# Altium project STM32F407_Board.PrjPcb (part 1 of 3)
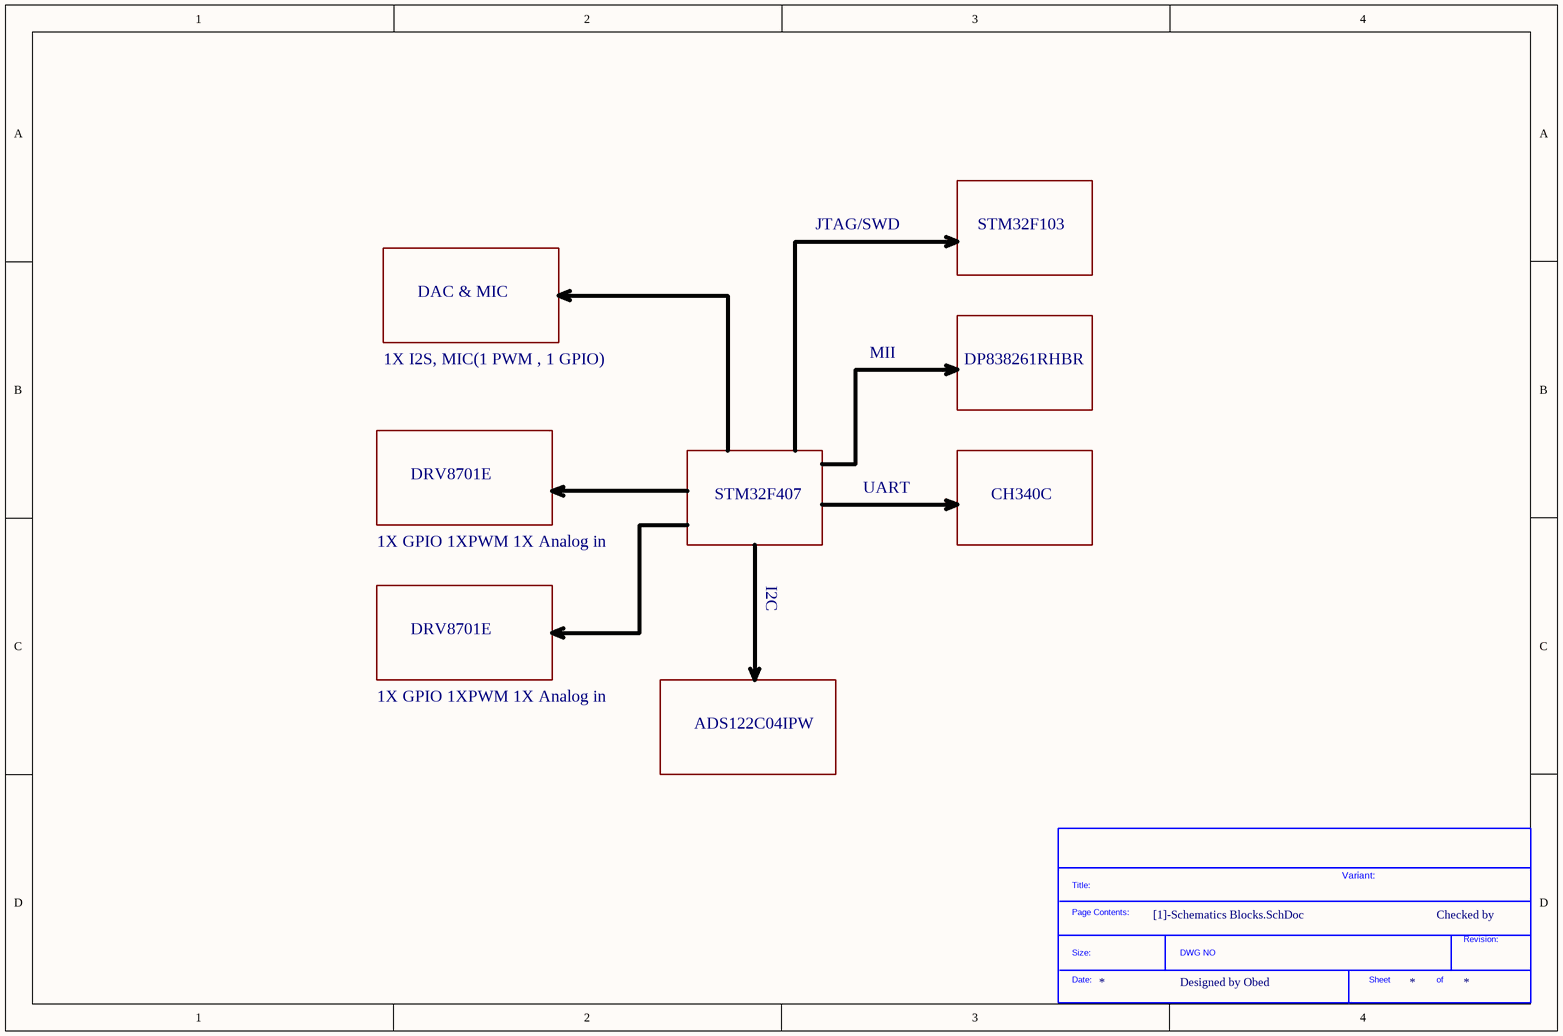
[diagram p0: [1]-Schematics Blocks.SchDoc]
11 sheets, 199 parts. Net scope: flat (ports and power ports of the same name join across sheets).
Board file: STM32F407_Board.PcbDoc
Sheets:
  [1]-Schematics Blocks.SchDoc
  [2]-Power Budget.SchDoc
  [3]-Debugger_STM32F103.SchDoc
  [4]-Ethernet_PHY.SchDoc
  [5]-Motor Driver_DRV8701.SchDoc
  [6]-CH340C.SchDoc
  [7]-ADC CHIP.SchDoc
  [8]-DAC & MIC.SchDoc
  [9]-STM32F407.SchDoc
  [10]-POWER.SchDoc
  [11]-Motor Driver_DRV8701_2.SchDoc

## Sheet [1]-Schematics Blocks.SchDoc
size A4

### Parts
(Parts that share a designator on the sheet are numbered #1, #2 ... from top to bottom, then left to right.)
*?#1  SDTitleBlock  (value not drawn)  (graphical)

### Notes on the sheet
- JTAG/SWD
- STM32F103
- DAC & MIC
- 1X I2S, MIC(1 PWM , 1 GPIO)
- MII
- DP838261RHBR
- DRV8701E
- STM32F407
- UART
- CH340C
- 1X GPIO 1XPWM 1X Analog in
- I2C
- ADS122C04IPW
- Variant:
- Checked by
- Designed by Obed
- (in symbol SDTitleBlock) Title:; Page Contents:; Revision:; Size:; DWG NO; Date:; Sheet; of

## Sheet [2]-Power Budget.SchDoc
size A4
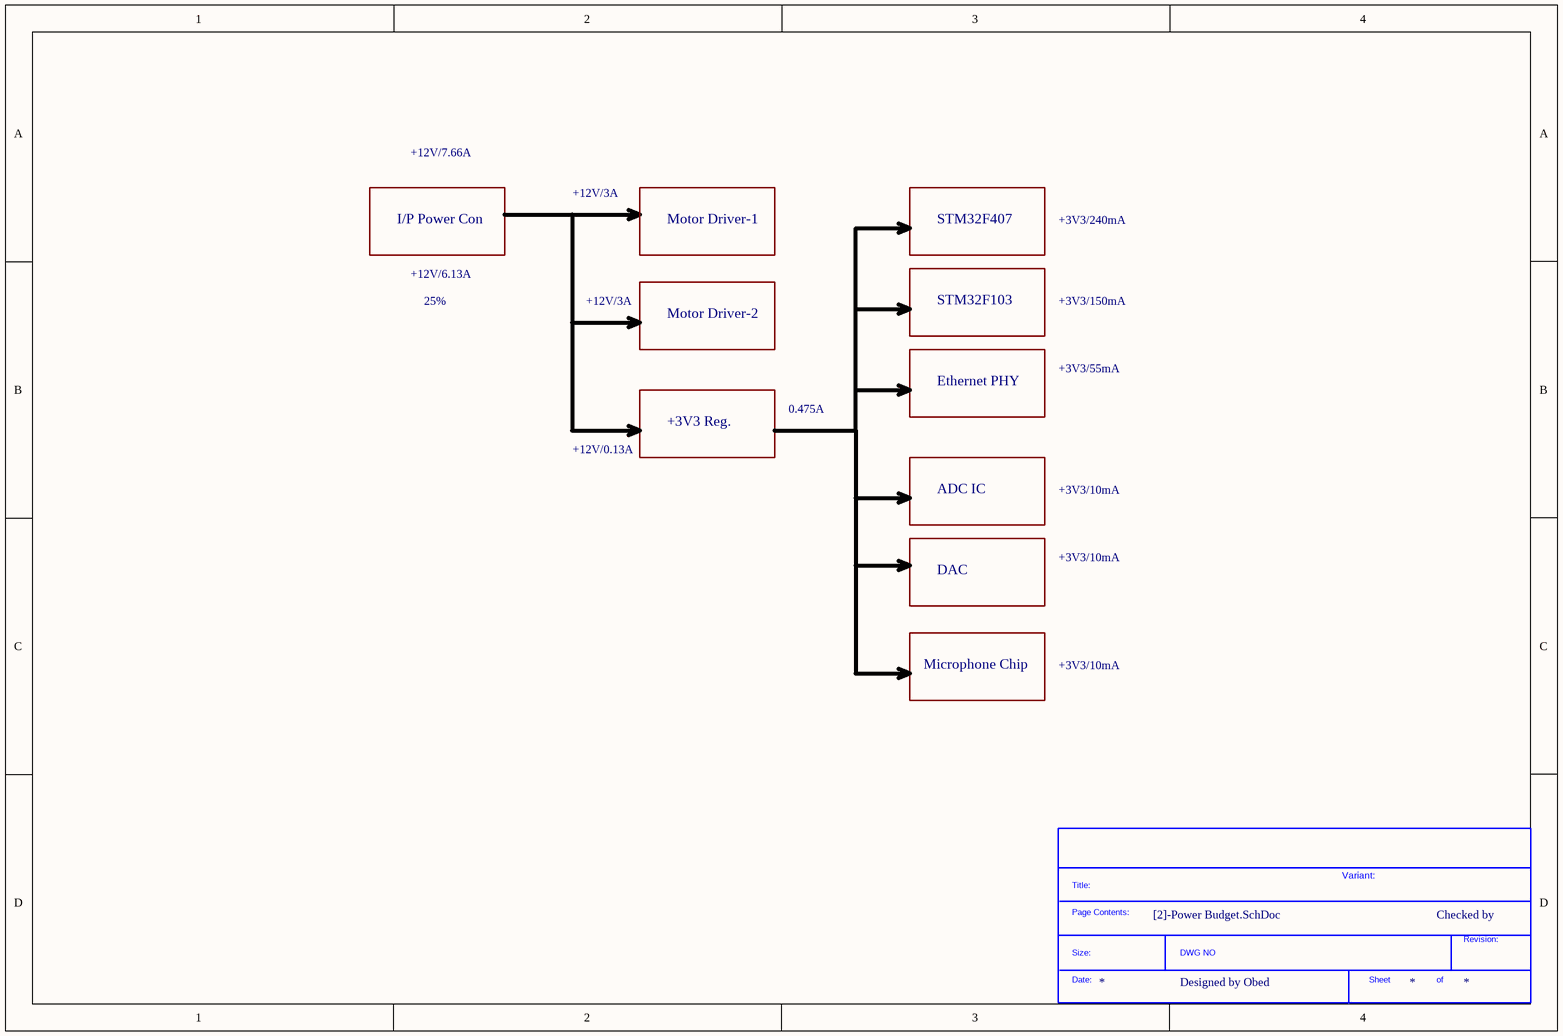
[diagram p1: [2]-Power Budget.SchDoc]

### Parts
(Parts that share a designator on the sheet are numbered #1, #2 ... from top to bottom, then left to right.)
*?#2  SDTitleBlock  (value not drawn)  (graphical)

### Notes on the sheet
- +12V/7.66A
- I/P Power Con
- +12V/3A
- Motor Driver-1
- STM32F407
- +3V3/240mA
- +12V/6.13A
- 25%
- STM32F103
- +3V3/150mA
- Motor Driver-2
- Ethernet PHY
- +3V3/55mA
- +3V3 Reg.
- 0.475A
- +12V/0.13A
- ADC IC
- +3V3/10mA
- DAC
- Microphone Chip
- Variant:
- Checked by
- Designed by Obed
- (in symbol SDTitleBlock) Title:; Page Contents:; Revision:; Size:; DWG NO; Date:; Sheet; of

## Sheet [3]-Debugger_STM32F103.SchDoc
size A4
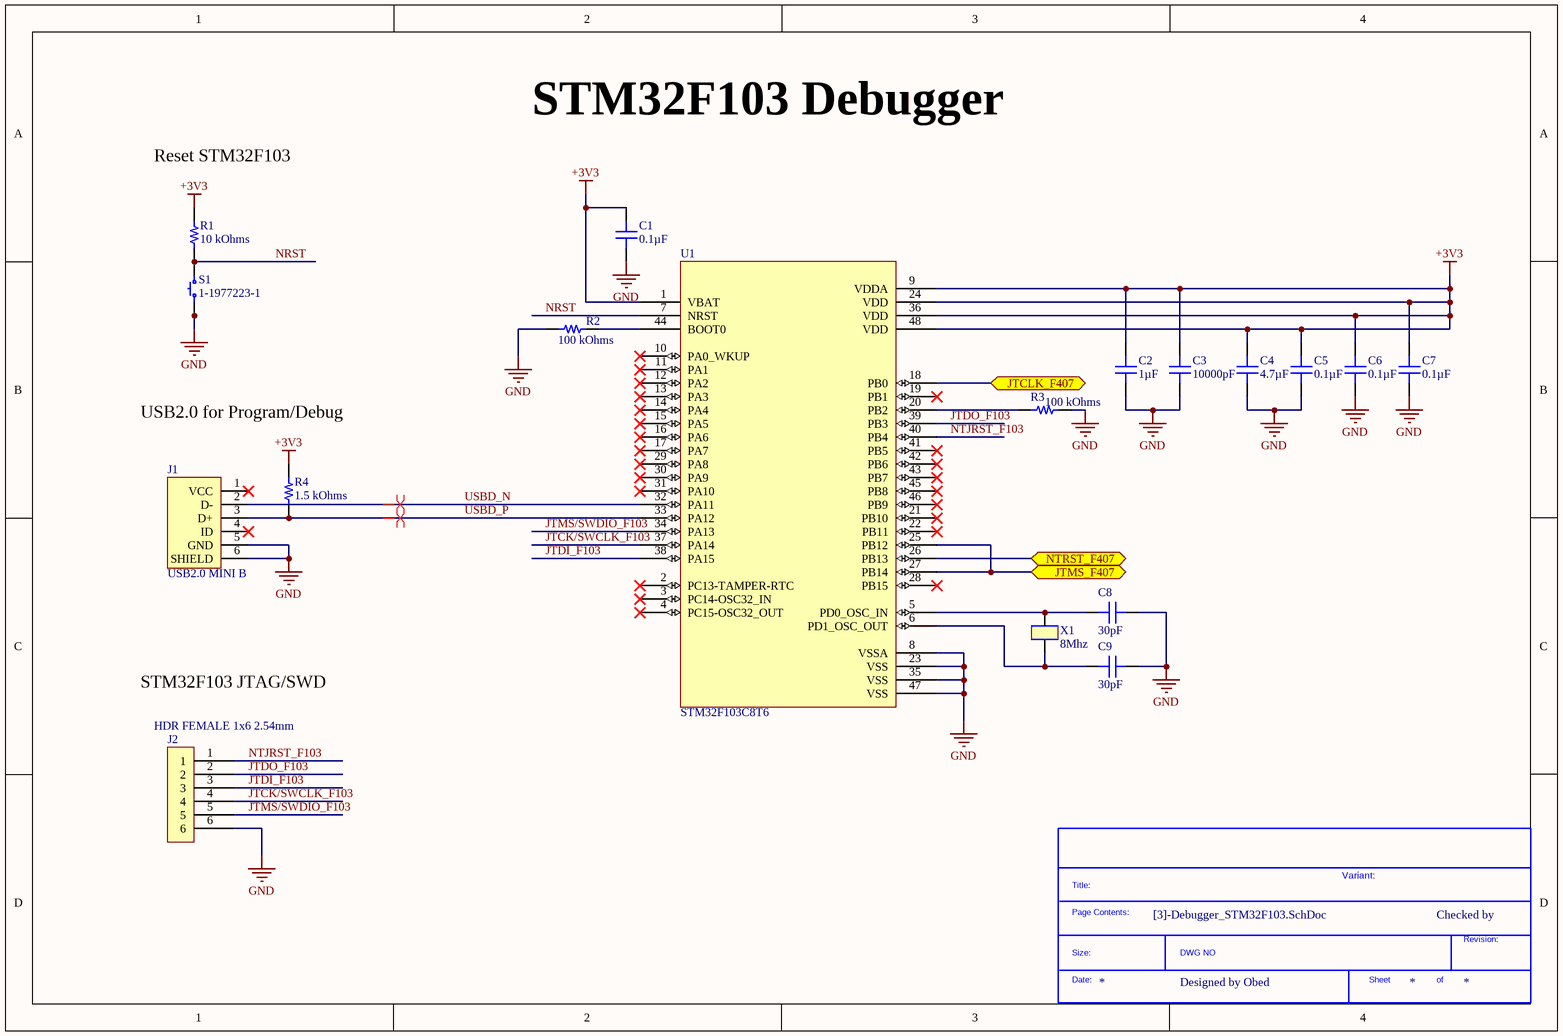
[diagram p2: [3]-Debugger_STM32F103.SchDoc]

### Parts
(Parts that share a designator on the sheet are numbered #1, #2 ... from top to bottom, then left to right.)
*?#3  SDTitleBlock  (value not drawn)  (graphical)
C1  0.1µF  [CAP 0805_2012]
C2  1µF  [CAP 0805_2012]
C3  10000pF  [CAP 0805_2012]
C4  4.7µF  [CAP 0805_2012]
C5  0.1µF  [CAP 0805_2012]
C6  0.1µF  [CAP 0805_2012]
C7  0.1µF  [CAP 0805_2012]
C8  30pF  [CAP 0805_2012]
C9  30pF  [CAP 0805_2012]
J1  USB2.0 MINI B  [CON_690-005-299-043]
J2  HDR FEMALE 1x6 2.54mm  [HDR_1x6_2.54mm]
R1  10 kOhms  [RES 0805_2012]
R2  100 kOhms  [RES 0805_2012]
R3  100 kOhms  [RES 0805_2012]
R4  1.5 kOhms  [RES 0805_2012]
S1  1-1977223-1  [TE FSM4JSMA]
U1  STM32F103C8T6  [LQFP-48_SMD]
X1  8Mhz  [XTAL_314_240X47_SMD]

### Ports
JTCLK_F407 (bidir), JTMS_F407 (bidir), NTRST_F407 (bidir)

### Nets
+3V3: C1.2 C2.2 C3.1 C4.2 C5.2 C6.2 C7.2 R1.2 R4.2 U1.1(VBAT) U1.9(VDDA) U1.24(VDD) U1.36(VDD) U1.48(VDD)
GND: C1.1 C2.1 C3.2 C4.1 C5.1 C6.1 C7.1 C8.2 C9.2 J1.5(GND) J1.6(SHIELD) J2.6 R2.1 R3.2 S1.1 S1.2 U1.8(VSSA) U1.23(VSS) U1.35(VSS) U1.47(VSS)
JTCK/SWCLK_F103: J2.4 U1.37(PA14)
JTDI_F103: J2.3 U1.38(PA15)
JTDO_F103: J2.2 U1.39(PB3)
JTMS/SWDIO_F103: J2.5 U1.34(PA13)
NRST: R1.1 S1.3 S1.4 U1.7(NRST)
NTJRST_F103: J2.1 U1.40(PB4)
NTRST_F407: U1.26(PB13) ; port NTRST_F407
USBD_N: J1.2(D-) U1.32(PA11)
USBD_P: J1.3(D+) R4.1 U1.33(PA12)
NetC8_1: C8.1 U1.5(PD0_OSC_IN) X1.2
NetC9_1: C9.1 U1.6(PD1_OSC_OUT) X1.1
NetR2_2: R2.2 U1.44(BOOT0)
NetR3_1: R3.1 U1.20(PB2)
NetU1_18: U1.18(PB0) ; port JTCLK_F407
NetU1_25: U1.25(PB12) U1.27(PB14) ; port JTMS_F407

Not connected (* = marked no-connect by the designer): J1 1(VCC)* 4(ID)*; U1 2(PC13-TAMPER-RTC)* 3(PC14-OSC32_IN)* 4(PC15-OSC32_OUT)* 10(PA0_WKUP)* 11(PA1)* 12(PA2)* 13(PA3)* 14(PA4)* 15(PA5)* 16(PA6)* 17(PA7)* 19(PB1)* 21(PB10)* 22(PB11)* 28(PB15)* 29(PA8)* 30(PA9)* 31(PA10)* 41(PB5)* 42(PB6)* 43(PB7)* 45(PB8)* 46(PB9)*

### Layout directives
differential pair; differential pair class DIFF90: USBD_N, USBD_P

### Notes on the sheet
- Reset STM32F103
- STM32F103 Debugger
- USB2.0 for Program/Debug
- STM32F103 JTAG/SWD
- Variant:
- Checked by
- Designed by Obed
- (in symbol SDTitleBlock) Title:; Page Contents:; Revision:; Size:; DWG NO; Date:; Sheet; of

### Library data of the parts
C1 C5-C7 = 0805J0500104KXT: CAP CER 0.1UF 50V X7R 0805; Manufacturer: Knowles Syfer; Tolerance: ±10%; Part Number: 0805J0500104KXT; Value: 0.1µF; Applications: General Purpose; Capacitance: 0.1µF; ComponentLink1Description: Datasheet; ComponentLink1URL: https://www.knowlescapacitors.com/getattachment/2dbfc8bc-e2b3-4b4d-afb1-43b011b9ebe0/High-Std-Voltage.aspx; ComponentLink2Description: DigiKey Link; ComponentLink2URL: http://digikey.com/product-detail/en/knowles-syfer/0805J0500104KXT/1608-1000-1-ND/5730199; Device Package: 0805 (2012 Metric); LastUpdated: 02/09/2020 01:04:31; Lifecycle Status: Active; Minimum Order: 1; Mounting Type: Surface Mount, MLCC; Operating Temperature: -55°C ~ 125°C; Package / Case: 0805 (2012 Metric); Packaging: TapeAndReel; PartId: 8322; Part Status: Active; Price: 0.17; Series: -; Size / Dimension: 0.079" L x 0.049" W (2.00mm x 1.25mm); Supplier 1: DigiKey; Supplier Part Number 1: 1608-1000-1-ND; Temperature Coefficient: X7R; Thickness (Max): 0.051" (1.30mm); Voltage - Rated: 50V
C2 = 08055C105K4T2A: CAP CER 1UF 50V X7R 0805; Manufacturer: AVX Corporation; Tolerance: ±10%; Part Number: 08055C105K4T2A; Value: 1µF; Applications: Automotive; Capacitance: 1µF; ComponentLink1Description: Datasheet; ComponentLink1URL: http://datasheets.avx.com/AutoMLCC.pdf; ComponentLink2Description: DigiKey Link; ComponentLink2URL: http://digikey.com/product-detail/en/avx-corporation/08055C105K4T2A/478-9556-1-ND/5322894; Device Package: 0805 (2012 Metric); LastUpdated: 02/09/2020 01:04:35; Lifecycle Status: Active; Minimum Order: 1; Mounting Type: Surface Mount, MLCC; Operating Temperature: -55°C ~ 125°C; Package / Case: 0805 (2012 Metric); Packaging: TapeAndReel; PartId: 6460; Part Status: Active; Price: 0.08; Ratings: AEC-Q200; Series: -; Size / Dimension: 0.079" L x 0.049" W (2.00mm x 1.25mm); Supplier 1: DigiKey; Supplier Part Number 1: 478-9556-1-ND; Temperature Coefficient: X7R; Thickness (Max): 0.055" (1.40mm); Voltage - Rated: 50V
C3 = C0805C103K5RECAUTO: CAP CER 0805 10NF 50V X7R 10%; Manufacturer: KEMET; Part Number: C0805C103K5RECAUTO; Value: 10000pF; Applications: Automotive, ESD Protection; Capacitance: 10000pF; ComponentLink1Description: Datasheet; ComponentLink1URL: https://api.kemet.com/component-edge/download/datasheet/C0805C103K5RECAUTO.pdf; ComponentLink2Description: DigiKey Link; ComponentLink2URL: http://digikey.com/product-detail/en/kemet/C0805C103K5RECAUTO/399-17885-1-ND/8640552; Device Package: 0805 (2012 Metric); LastUpdated: 02/09/2020 01:04:31; Lifecycle Status: Active; Minimum Order: 1; Mounting Type: Surface Mount, MLCC; Operating Temperature: -55°C ~ 125°C; Package / Case: 0805 (2012 Metric); Packaging: TapeAndReel; PartId: 8498; Part Status: Active; Price: 0.05; Ratings: AEC-Q200; Series: ESD SMD Auto X7R; Size / Dimension: 0.079" L x 0.049" W (2.00mm x 1.25mm); Supplier 1: DigiKey; Supplier Part Number 1: 399-17885-1-ND; Temperature Coefficient: X7R; Thickness (Max): 0.035" (0.88mm); Tolerance: ±10%; Voltage - Rated: 50V
C4 = C2012JB1H475K125AB: CAP CER 4.7UF 50V JB 0805; Manufacturer: TDK Corporation; Tolerance: ±10%; Part Number: C2012JB1H475K125AB; Value: 4.7µF; Applications: General Purpose; Capacitance: 4.7µF; ComponentLink1Description: Datasheet; ComponentLink1URL: https://product.tdk.com/info/en/catalog/datasheets/mlcc_commercial_general_en.pdf?ref_disty=digikey; ComponentLink2Description: DigiKey Link; ComponentLink2URL: http://digikey.com/product-detail/en/tdk-corporation/C2012JB1H475K125AB/445-11510-1-ND/3953176; Device Package: 0805 (2012 Metric); Features: Low ESL; LastUpdated: 02/09/2020 01:04:16; Lifecycle Status: Active; Minimum Order: 1; Mounting Type: Surface Mount, MLCC; Operating Temperature: -25°C ~ 85°C; Package / Case: 0805 (2012 Metric); Packaging: TapeAndReel; PartId: 15333; Part Status: Active; Price: 0.18; Series: C; Size / Dimension: 0.079" L x 0.049" W (2.00mm x 1.25mm); Supplier 1: DigiKey; Supplier Part Number 1: 445-11510-1-ND; Temperature Coefficient: JB; Thickness (Max): 0.057" (1.45mm); Voltage - Rated: 50V
C8 C9 = C0805C300K5GAC7800: CAP CER 30PF 50V NP0 0805; Manufacturer: KEMET; Temperature Coefficient: C0G, NP0; Tolerance: ±10%; Part Number: C0805C300K5GAC7800; Value: 30pF; Applications: General Purpose; Capacitance: 30pF; ComponentLink1Description: Datasheet; ComponentLink1URL: https://api.kemet.com/component-edge/download/datasheet/C0805C300K5GACTU.pdf; ComponentLink2Description: DigiKey Link; ComponentLink2URL: http://digikey.com/product-detail/en/kemet/C0805C300K5GAC7800/399-17443-1-ND/8570410; Device Package: 0805 (2012 Metric); Features: Low ESL; LastUpdated: 02/09/2020 01:04:24; Lifecycle Status: Active; Minimum Order: 1; Mounting Type: Surface Mount, MLCC; Operating Temperature: -55°C ~ 125°C; Package / Case: 0805 (2012 Metric); Packaging: TapeAndReel; PartId: 12424; Part Status: Active; Price: 0.06; Series: SMD Comm C0G; Size / Dimension: 0.079" L x 0.049" W (2.00mm x 1.25mm); Supplier 1: DigiKey; Supplier Part Number 1: 399-17443-1-ND; Thickness (Max): 0.035" (0.88mm); Voltage - Rated: 50V
J1 = CON_USB2.0-MINIB-SMD: Conn Mini USB 2.0 Type B RCP 5 POS 0.8mm Solder RA SMD 5 Terminal 1 Port; Manufacturer: EDAC; Manufacturer Part Number: 690-005-299-043; Supplier 1: Digi-Key; Category: USB Connectors; Pricing 1: 1=0.65000, 10=0.60600, 25=0.54560, 50=0.48480, 100=0.46460, 250=0.42420, 500=0.40400 (USD); Mount: Surface Mount,Horizontal; Pitch: 0.8mm; ComponentLink1URL: https://datasheet.ciiva.com/29660/690-005-299-043-29660027.pdf?src-supplier=Digi-Key; ComponentLink1Description: https://datasheet.ciiva.com/29660/690-005-299-043-29660027.pdf?src-supplier=Digi-Key; ComponentLink2URL: https://datasheet.ciiva.com/30246/690-005-299-043-30246515.pdf?src-supplier=Onlinecomponents.com; ComponentLink2Description: https://datasheet.ciiva.com/30246/690-005-299-043-30246515.pdf?src-supplier=Onlinecomponents.com; ComponentLink3URL: https://datasheet.ciiva.com/29660/690-005-299-043-29660028.pdf?src-supplier=Digi-Key; ComponentLink3Description: https://datasheet.ciiva.com/29660/690-005-299-043-29660028.pdf?src-supplier=Digi-Key; ComponentLink4URL: https://datasheet.ciiva.com/29660/690-005-299-043-29660029.pdf?src-supplier=Digi-Key; ComponentLink4Description: https://datasheet.ciiva.com/29660/690-005-299-043-29660029.pdf?src-supplier=Digi-Key
J2 = HDR _1x6: 06-WAY
R1 = CRCW080510K0FKEA: RES SMD 10K OHM 1% 1/8W 0805; Manufacturer: Vishay Dale; Power (Watts): 0.125W, 1/8W; Temperature Coefficient: ±100ppm/°C; Part Number: CRCW080510K0FKEA; Value: 10 kOhms; ComponentLink1Description: Datasheet; ComponentLink1URL: http://www.vishay.com/docs/20035/dcrcwe3.pdf; ComponentLink2Description: DigiKey Link; ComponentLink2URL: http://digikey.com/product-detail/en/vishay-dale/CRCW080510K0FKEA/541-10.0KCCT-ND/1180897; Composition: Thick Film; Device Package: 0805 (2012 Metric); Features: Automotive AEC-Q200; Height - Seated (Max): 0.020" (0.50mm); LastUpdated: 02/09/2020 01:15:23; Lifecycle Status: Active; Minimum Order: 1; Number of Terminations: 2; Operating Temperature: -55°C ~ 155°C; Package / Case: 0805 (2012 Metric); Packaging: TapeAndReel; PartId: 28101; Part Status: Active; Price: 0.01; Ratings: AEC-Q200; Resistance: 10 kOhms; Series: CRCW; Size / Dimension: 0.079" L x 0.049" W (2.00mm x 1.25mm); Supplier 1: DigiKey; Supplier Part Number 1: 541-10.0KCCT-ND; Supplier Device Package: 0805; Tolerance: ±1%
R2 R3 = CRCW0805100KFKEB: RES SMD 100K OHM 1% 1/8W 0805; Manufacturer: Vishay Dale; Power (Watts): 0.125W, 1/8W; Temperature Coefficient: ±100ppm/°C; Part Number: CRCW0805100KFKEB; Value: 100 kOhms; ComponentLink1Description: Datasheet; ComponentLink1URL: http://www.vishay.com/docs/20035/dcrcwe3.pdf; ComponentLink2Description: DigiKey Link; ComponentLink2URL: http://digikey.com/product-detail/en/vishay-dale/CRCW0805100KFKEB/541-4318-1-ND/8565931; Composition: Thick Film; Device Package: 0805 (2012 Metric); Features: Automotive AEC-Q200; Height - Seated (Max): 0.020" (0.50mm); LastUpdated: 02/09/2020 01:15:19; Lifecycle Status: Active; Minimum Order: 1; Number of Terminations: 2; Operating Temperature: -55°C ~ 155°C; Package / Case: 0805 (2012 Metric); Packaging: TapeAndReel; PartId: 30012; Part Status: Active; Price: 0.01; Ratings: AEC-Q200; Resistance: 100 kOhms; Series: CRCW; Size / Dimension: 0.079" L x 0.049" W (2.00mm x 1.25mm); Supplier 1: DigiKey; Supplier Part Number 1: 541-4318-1-ND; Supplier Device Package: 0805; Tolerance: ±1%
R4 = RC0805FR-071K5L: RES SMD 1.5K OHM 1% 1/8W 0805; Manufacturer: Yageo; Power (Watts): 0.125W, 1/8W; Temperature Coefficient: ±100ppm/°C; Part Number: RC0805FR-071K5L; Value: 1.5 kOhms; ComponentLink1Description: Datasheet; ComponentLink1URL: https://www.yageo.com/upload/media/product/productsearch/datasheet/rchip/PYu-RC_Group_51_RoHS_L_10.pdf; ComponentLink2Description: DigiKey Link; ComponentLink2URL: http://digikey.com/product-detail/en/yageo/RC0805FR-071K5L/311-1.50KCRCT-ND/730443; Composition: Thick Film; Device Package: 0805 (2012 Metric); Features: Moisture Resistant; Height - Seated (Max): 0.024" (0.60mm); LastUpdated: 02/09/2020 01:15:14; Lifecycle Status: Active; Minimum Order: 1; Number of Terminations: 2; Operating Temperature: -55°C ~ 155°C; Package / Case: 0805 (2012 Metric); Packaging: CutTape; PartId: 32611; Part Status: Active; Price: 0.10; Resistance: 1.5 kOhms; Series: RC; Size / Dimension: 0.079" L x 0.049" W (2.00mm x 1.25mm); Supplier 1: DigiKey; Supplier Part Number 1: 311-1.50KCRCT-ND; Supplier Device Package: 0805; Tolerance: ±1%
S1 = 1-1977223-1: SWITCH TACTILE SPST-NO 0.05A 24V; Manufacturer: TE Connectivity ALCOSWITCH Switches; Actuator Height off PCB, Vertical: 5.00mm; Actuator Orientation: Top Actuated; Actuator Type: Standard; Contact Rating @ Voltage: 0.05A @ 24VDC; Illumination: Non-Illuminated; Operating Force: 260gf; Outline: 6.00mm x 6.00mm; Switch Function: Off-Mom; Part Number: 1-1977223-1; Circuit: SPST-NO; ComponentLink1Description: Datasheet; ComponentLink1URL: https://www.te.com/commerce/DocumentDelivery/DDEController?Action=srchrtrv&DocNm=1308111-1_SWITCHES_CORE_PROGRAM_CATALOG&DocType=CS&DocLang=English; ComponentLink2Description: DigiKey Link; ComponentLink2URL: http://digikey.com/product-detail/en/te-connectivity-alcoswitch-switches/1-1977223-1/1-1977223-1-ND/5597032; LastUpdated: 02/09/2020 01:27:07; Lifecycle Status: Active; Minimum Order: 0; Mounting Type: Surface Mount; Price: 0; Series: FSMJSMA; Supplier 1: DigiKey; Supplier Part Number 1: 1-1977223-1-ND; Termination Style: Gull Wing
U1 = IC_STM32F103C8T6: STMICROELECTRONICS - STM32F103C8T6 - ARM MCU, Motor Control, STM32 Family STM32F1 Series Microcontrollers, ARM Cortex-M3, 32bit, 72 MHz; Number of I/Os: 37; Supplier 1: Digi-Key; Manufacturer: STMicroelectronics; Manufacturer Part Number: STM32F103C8T6; Category: Microcontrollers; Pricing 1: 1=5.95000, 10=5.34300, 25=5.05120, 80=4.37763, 250=4.15316, 500=3.72664, 1000=3.27390 (USD); Case/Package: LQFP; Number of Pins: 48; ComponentLink1URL: https://datasheet.ciiva.com/15122/getdatasheetpartid-69880-15122076.pdf?src-supplier=Verical; ComponentLink1Description: https://datasheet.ciiva.com/15122/getdatasheetpartid-69880-15122076.pdf?src-supplier=Verical; ComponentLink2URL: https://datasheet.ciiva.com/26816/stm32f103c8t6-26816902.pdf?src-supplier=IIIC; ComponentLink2Description: https://datasheet.ciiva.com/26816/stm32f103c8t6-26816902.pdf?src-supplier=IIIC; ComponentLink3URL: https://datasheet.ciiva.com/16210/cd00161566-16210248.pdf?src-supplier=Future+Electronics; ComponentLink3Description: https://datasheet.ciiva.com/16210/cd00161566-16210248.pdf?src-supplier=Future+Electronics; ComponentLink4URL: https://datasheet.ciiva.com/14100/pustm-arm-microcont-stm32f103-en-14100508.pdf?src-supplier=Distrelec; ComponentLink4Description: https://datasheet.ciiva.com/14100/pustm-arm-microcont-stm32f103-en-14100508.pdf?src-supplier=Distrelec; ComponentLink5URL: https://datasheet.ciiva.com/8054/1730126-8054942.pdf?src-supplier=Element14; ComponentLink5Description: https://datasheet.ciiva.com/8054/1730126-8054942.pdf?src-supplier=Element14; ComponentLink6URL: https://datasheet.ciiva.com/48687/001075658-da-01-en-mcu-64kb-mem-stm32f103c8t6-lqfp-48-stm-48687589.pdf?src-supplier=Conrad; ComponentLink6Description: https://datasheet.ciiva.com/48687/001075658-da-01-en-mcu-64kb-mem-stm32f103c8t6-lqfp-48-stm-48687589.pdf?src-supplier=Conrad
X1 = XTAL_8MHZ-ECS-80-32-5PX-SMD: CRYSTAL 8.0000MHZ 32PF SMD; Manufacturer: ECS International; Manufacturer Part Number: ECS-80-32-5PX-TR; Supplier 1: Digi-Key; Category: Crystals; Stock 1: 1261; Pricing 1: 1=0.45000, 10=0.37500, 50=0.33760, 100=0.30000, 500=0.28500 (USD); Packaging: Tape and Reel; ComponentLink1URL: https://datasheet.ciiva.com/852/csm-7x-852413.pdf?src-supplier=Digi-Key; ComponentLink1Description: https://datasheet.ciiva.com/852/csm-7x-852413.pdf?src-supplier=Digi-Key; ComponentLink2URL: https://datasheet.ciiva.com/852/csm-7x-852414.pdf?src-supplier=Digi-Key; ComponentLink2Description: https://datasheet.ciiva.com/852/csm-7x-852414.pdf?src-supplier=Digi-Key; ComponentLink3URL: https://datasheet.ciiva.com/852/csm-7x-852415.pdf?src-supplier=Digi-Key; ComponentLink3Description: https://datasheet.ciiva.com/852/csm-7x-852415.pdf?src-supplier=Digi-Key; Supplier Part Number 1: XC1272CT-ND

## Sheet [4]-Ethernet_PHY.SchDoc
size A4
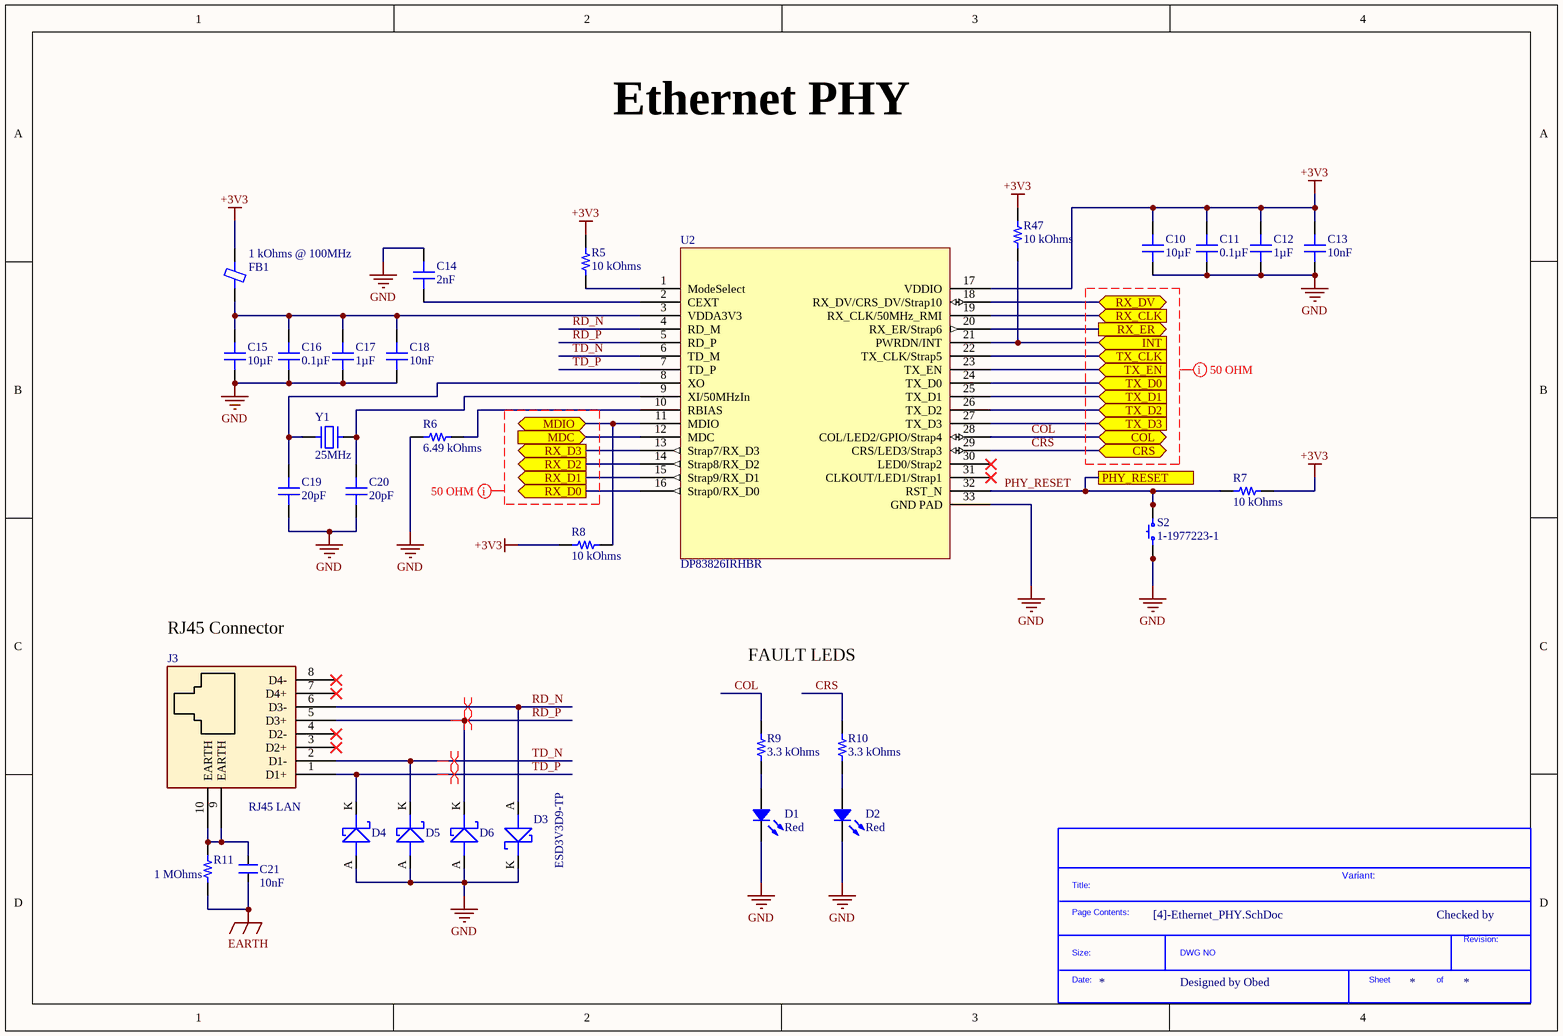
[diagram p3: [4]-Ethernet_PHY.SchDoc]

### Parts
(Parts that share a designator on the sheet are numbered #1, #2 ... from top to bottom, then left to right.)
*?#4  SDTitleBlock  (value not drawn)  (graphical)
C10  10µF  [CAP 1206_3216 - 1.8MM]
C11  0.1µF  [CAP 0805_2012]
C12  1µF  [CAP 0805_2012]
C13  10nF  [CAP 0805_2012]
C14  2nF  [CAP 0805_2012]
C15  10µF  [CAP 1206_3216 - 1.8MM]
C16  0.1µF  [CAP 0805_2012]
C17  1µF  [CAP 0805_2012]
C18  10nF  [CAP 0805_2012]
C19  20pF  [CAP 0805_2012]
C20  20pF  [CAP 0805_2012]
C21  10nF  [CAP_P196_102X287_H332_RAD_TH]
D1  Red  [LED 1206_3216 RED]
D2  Red  [LED 1206_3216 RED]
D3  ESD3V3D9-TP  [DIO_SOD-923]
D4  ESD3V3D9-TP  [DIO_SOD-923]  (value not drawn)
D5  ESD3V3D9-TP  [DIO_SOD-923]  (value not drawn)
D6  ESD3V3D9-TP  [DIO_SOD-923]  (value not drawn)
FB1  1 kOhms @ 100MHz  [FER 1206_3216]
J3  RJ45 LAN  [CON10_P106_RJ45_TH_ST]
R5  10 kOhms  [RES 0805_2012]
R6  6.49 kOhms  [RES 0805_2012]
R7  10 kOhms  [RES 0805_2012]
R8  10 kOhms  [RES 0805_2012]
R9  3.3 kOhms  [RES 0603_1608]
R10  3.3 kOhms  [RES 0603_1608]
R11  1 MOhms  [RES 1206_3216]
R47  10 kOhms  [RES 0805_2012]
S2  1-1977223-1  [TE FSM4JSMA]
U2  DP83826IRHBR  [VQFN32_19_218_23X9_SMD]
Y1  25MHz  [ABRACON ABLS]

### Ports
COL (bidir), CRS (bidir), INT (in), MDC (in), MDIO (bidir), PHY_RESET, RX_CLK (in), RX_D0 (out), RX_D1 (out), RX_D2 (out), RX_D3 (out), RX_DV (bidir), RX_ER (out), TX_CLK (in), TX_D0 (in), TX_D1 (in), TX_D2 (in), TX_D3 (in), TX_EN (in)

### Nets
+3V3: C10.2 C11.2 C12.2 C13.2 FB1.1 R5.1 R7.1 R8.1 R47.1 U2.17(VDDIO)
EARTH: C21.1 R11.1
GND: C10.1 C11.1 C12.1 C13.1 C14.1 C15.1 C16.1 C17.1 C18.1 C19.1 C20.1 D1.2 D2.2 D3.K D4.A D5.A D6.A R6.1 S2.1 S2.2 U2.33(GND_PAD)
COL: R9.2 U2.28(COL/LED2/GPIO/Strap4) ; port COL
CRS: R10.2 U2.29(CRS/LED3/Strap3) ; port CRS
PHY_RESET: R7.2 S2.3 S2.4 U2.32(RST_N) ; port PHY_RESET
RD_N: D3.A J3.6(D3-) U2.4(RD_M)
RD_P: D6.K J3.5(D3+) U2.5(RD_P)
TD_N: D5.K J3.2(D1-) U2.6(TD_M)
TD_P: D4.K J3.1(D1+) U2.7(TD_P)
NetC14_2: C14.2 U2.2(CEXT)
NetC15_2: C15.2 C16.2 C17.2 C18.2 FB1.2 U2.3(VDDA3V3)
NetC19_2: C19.2 U2.8(XO) Y1.1
NetC20_2: C20.2 U2.9(XI/50MHzIn) Y1.2
NetC21_2: C21.2 J3.9(EARTH) J3.10(EARTH) R11.2
NetD1_1: D1.1 R9.1
NetD2_1: D2.1 R10.1
NetR5_2: R5.2 U2.1(ModeSelect)
NetR6_2: R6.2 U2.10(RBIAS)
NetR8_2: R8.2 U2.11(MDIO) ; port MDIO
NetR47_2: R47.2 U2.21(PWRDN/INT) ; port INT
NetU2_12: U2.12(MDC) ; port MDC
NetU2_13: U2.13(Strap7/RX_D3) ; port RX_D3
NetU2_14: U2.14(Strap8/RX_D2) ; port RX_D2
NetU2_15: U2.15(Strap9/RX_D1) ; port RX_D1
NetU2_16: U2.16(Strap0/RX_D0) ; port RX_D0
NetU2_18: U2.18(RX_DV/CRS_DV/Strap10) ; port RX_DV
NetU2_19: U2.19(RX_CLK/50MHz_RMI) ; port RX_CLK
NetU2_20: U2.20(RX_ER/Strap6) ; port RX_ER
NetU2_22: U2.22(TX_CLK/Strap5) ; port TX_CLK
NetU2_23: U2.23(TX_EN) ; port TX_EN
NetU2_24: U2.24(TX_D0) ; port TX_D0
NetU2_25: U2.25(TX_D1) ; port TX_D1
NetU2_26: U2.26(TX_D2) ; port TX_D2
NetU2_27: U2.27(TX_D3) ; port TX_D3

Not connected (* = marked no-connect by the designer): J3 3(D2+)* 4(D2-)* 7(D4+)* 8(D4-)*; U2 30(LED0/Strap2)* 31(CLKOUT/LED1/Strap1)*

### Layout directives
net class 50OHM SINGLE-ENDED: (no net found under the mark)
differential pair; differential pair class 100 OHM; net class DIFF100: RD_N, RD_P, TD_N, TD_P

### Notes on the sheet
- Ethernet PHY
- (near J3) RJ45 Connector
- FAULT LEDS
- Variant:
- Checked by
- Designed by Obed
- (in symbol SDTitleBlock) Title:; Page Contents:; Revision:; Size:; DWG NO; Date:; Sheet; of

### Library data of the parts
C10 C15 = 12065D106KAT2A: CAP CER 10UF 50V X5R 1206; Manufacturer: AVX Corporation; Tolerance: ±10%; Part Number: 12065D106KAT2A; Value: 10µF; Applications: General Purpose; Capacitance: 10µF; ComponentLink1Description: Datasheet; ComponentLink1URL: http://datasheets.avx.com/cx5r.pdf; ComponentLink2Description: DigiKey Link; ComponentLink2URL: http://digikey.com/product-detail/en/avx-corporation/12065D106KAT2A/478-9979-1-ND/6149060; Device Package: 1206 (3216 Metric); LastUpdated: 02/09/2020 01:05:35; Lifecycle Status: Active; Minimum Order: 1; Mounting Type: Surface Mount, MLCC; Operating Temperature: -55°C ~ 85°C; Package / Case: 1206 (3216 Metric); Packaging: TapeAndReel; PartId: 21345; Part Status: Active; Price: 0.16; Series: -; Size / Dimension: 0.126" L x 0.063" W (3.20mm x 1.60mm); Supplier 1: DigiKey; Supplier Part Number 1: 478-9979-1-ND; Temperature Coefficient: X5R; Thickness (Max): 0.071" (1.80mm); Voltage - Rated: 50V
C11 C16 = 0805J0500104KXT: as C1 on sheet [3]-Debugger_STM32F103; Part Number: 0805J0500104KXT; Value: 0.1µF; Applications: General Purpose; Capacitance: 0.1µF; ComponentLink1Description: Datasheet; ComponentLink1URL: https://www.knowlescapacitors.com/getattachment/2dbfc8bc-e2b3-4b4d-afb1-43b011b9ebe0/High-Std-Voltage.aspx; ComponentLink2Description: DigiKey Link; ComponentLink2URL: http://digikey.com/product-detail/en/knowles-syfer/0805J0500104KXT/1608-1000-1-ND/5730199; Device Package: 0805 (2012 Metric); LastUpdated: 02/09/2020 01:04:31; Lifecycle Status: Active; Minimum Order: 1; Mounting Type: Surface Mount, MLCC; Operating Temperature: -55°C ~ 125°C; Package / Case: 0805 (2012 Metric); Packaging: TapeAndReel; PartId: 8322; Part Status: Active; Price: 0.17; Series: -; Size / Dimension: 0.079" L x 0.049" W (2.00mm x 1.25mm); Supplier 1: DigiKey; Supplier Part Number 1: 1608-1000-1-ND; Temperature Coefficient: X7R; Thickness (Max): 0.051" (1.30mm); Voltage - Rated: 50V
C12 C17 = 08055C105K4T2A: as C2 on sheet [3]-Debugger_STM32F103; Part Number: 08055C105K4T2A; Value: 1µF; Applications: Automotive; Capacitance: 1µF; ComponentLink1Description: Datasheet; ComponentLink1URL: http://datasheets.avx.com/AutoMLCC.pdf; ComponentLink2Description: DigiKey Link; ComponentLink2URL: http://digikey.com/product-detail/en/avx-corporation/08055C105K4T2A/478-9556-1-ND/5322894; Device Package: 0805 (2012 Metric); LastUpdated: 02/09/2020 01:04:35; Lifecycle Status: Active; Minimum Order: 1; Mounting Type: Surface Mount, MLCC; Operating Temperature: -55°C ~ 125°C; Package / Case: 0805 (2012 Metric); Packaging: TapeAndReel; PartId: 6460; Part Status: Active; Price: 0.08; Ratings: AEC-Q200; Series: -; Size / Dimension: 0.079" L x 0.049" W (2.00mm x 1.25mm); Supplier 1: DigiKey; Supplier Part Number 1: 478-9556-1-ND; Temperature Coefficient: X7R; Thickness (Max): 0.055" (1.40mm); Voltage - Rated: 50V
C13 C18 = C0805C103K5GECAUTO: CAP CER 0805 10NF 50V C0G 10%; Manufacturer: KEMET; Capacitance: 10000pF; Temperature Coefficient: C0G, NP0; Part Number: C0805C103K5GECAUTO; Value: 10nF; Applications: Automotive, ESD Protection; ComponentLink1Description: Datasheet; ComponentLink1URL: https://api.kemet.com/component-edge/download/datasheet/C0805C103K5GECAUTO.pdf; ComponentLink2Description: DigiKey Link; ComponentLink2URL: http://digikey.com/product-detail/en/kemet/C0805C103K5GECAUTO/399-17903-1-ND/8640570; Device Package: 0805 (2012 Metric); Features: Low ESL; LastUpdated: 02/09/2020 01:04:06; Lifecycle Status: Active; Minimum Order: 1; Mounting Type: Surface Mount, MLCC; Operating Temperature: -55°C ~ 125°C; Package / Case: 0805 (2012 Metric); Packaging: TapeAndReel; PartId: 18336; Part Status: Active; Price: 0.06; Ratings: AEC-Q200; Series: ESD SMD Auto C0G; Size / Dimension: 0.079" L x 0.049" W (2.00mm x 1.25mm); Supplier 1: DigiKey; Supplier Part Number 1: 399-17903-1-ND; Thickness (Max): 0.039" (1.00mm); Tolerance: ±10%; Voltage - Rated: 50V
C14 = C0805C202K5RACTU: CAP CER 2000PF 50V X7R 0805; Manufacturer: KEMET; Tolerance: ±10%; Part Number: C0805C202K5RACTU; Value: 2nF; Applications: Bypass, Decoupling; Capacitance: 2000pF; ComponentLink1Description: Datasheet; ComponentLink1URL: https://content.kemet.com/datasheets/KEM_C1002_X7R_SMD.pdf; ComponentLink2Description: DigiKey Link; ComponentLink2URL: http://digikey.com/product-detail/en/kemet/C0805C202K5RACTU/399-7343-1-ND/3316964; Device Package: 0805 (2012 Metric); LastUpdated: 02/09/2020 01:04:17; Lifecycle Status: Active; Minimum Order: 1; Mounting Type: Surface Mount, MLCC; Operating Temperature: -55°C ~ 125°C; Package / Case: 0805 (2012 Metric); Packaging: TapeAndReel; PartId: 14983; Part Status: Active; Price: 0.03; Series: SMD Comm X7R; Size / Dimension: 0.079" L x 0.049" W (2.00mm x 1.25mm); Supplier 1: DigiKey; Supplier Part Number 1: 399-7343-1-ND; Temperature Coefficient: X7R; Thickness (Max): 0.035" (0.88mm); Voltage - Rated: 50V
C19 C20 = 08055A200F4T2A: CAP CER 20PF 50V NP0 0805; Manufacturer: AVX Corporation; Temperature Coefficient: C0G, NP0; Tolerance: ±1%; Part Number: 08055A200F4T2A; Value: 20pF; Applications: Automotive; Capacitance: 20pF; ComponentLink1Description: Datasheet; ComponentLink1URL: http://datasheets.avx.com/C0GNP0-Dielectric.pdf; ComponentLink2Description: DigiKey Link; ComponentLink2URL: http://digikey.com/product-detail/en/avx-corporation/08055A200F4T2A/478-13059-1-ND/9948577; Device Package: 0805 (2012 Metric); LastUpdated: 02/09/2020 01:04:29; Lifecycle Status: Active; Minimum Order: 1; Mounting Type: Surface Mount, MLCC; Operating Temperature: -55°C ~ 125°C; Package / Case: 0805 (2012 Metric); Packaging: TapeAndReel; PartId: 9474; Part Status: Active; Price: 0.11; Ratings: AEC-Q200; Series: -; Size / Dimension: 0.079" L x 0.049" W (2.01mm x 1.25mm); Supplier 1: DigiKey; Supplier Part Number 1: 478-13059-1-ND; Voltage - Rated: 50V
C21 = CAP_10nF-1KV-10%-RAD-TH: Cap Ceramic 0.001uF 1000V X7R 10% Radial 5mm 125°C Bulk; Manufacturer: Murata; Manufacturer Part Number: RDER73A102K2K1H03B; Capacitance: 1nF; Voltage Rating: 1kV; Lead/Base Style: Formed Leads; Lead Diameter: 0.5mm; Supplier 1: Digi-Key; RoHS: Yes; Category: Ceramic Capacitors; Stock 1: 6888; Pricing 1: 1=0.75000, 10=0.53200, 50=0.40220, 100=0.35030, 500=0.25946, 1000=0.22055, 2500=0.20758, 5000=0.19460 (USD); Mount: Through Hole; Case/Package: Radial; Min Operating Temperature: -55°C; Max Operating Temperature: 125°C; Package Quantity: 500; Packaging: Bulk; Tolerance: 10%; Dielectric: X7R; Termination: Radial; Resistor Type: Ceramic; Voltage Rating (DC): 1kV; Length: 5.5mm; Width: 0.124inch; Height: 4mm; Height - Seated (Max): 0.157inch; Lead Pitch: 0.197inch; Lead Free: Lead Free; RoHS Compliant: Yes; ComponentLink1URL: https://datasheet.ciiva.com/29539/product-29539129.pdf?src-supplier=Digi-Key; ComponentLink1Description: https://datasheet.ciiva.com/29539/product-29539129.pdf?src-supplier=Digi-Key; Supplier Part Number 1: 490-8942-ND
D1 D2 = APTR3216SECK/J3-PRV: LED SMD; Manufacturer: Kingbright; Configuration: 1206; Current - Test: 20mA; Lens Color: Colorless; Lens Size: 1.60mm x 1.40mm; Lens Style: Rectangle with Flat Top; Lens Transparency: Clear; Millicandela Rating: 350mcd; Viewing Angle: 140°; Voltage - Forward (Vf) (Typ): 2.2V; Wavelength - Dominant: 625nm; Wavelength - Peak: 640nm; Part Number: APTR3216SECK/J3-PRV; Color: Red; ComponentLink1Description: Datasheet; ComponentLink1URL: http://www.kingbrightusa.com/images/catalog/SPEC/APTR3216SECK-J3-PRV.pdf; ComponentLink2Description: DigiKey Link; ComponentLink2URL: http://digikey.com/product-detail/en/kingbright/APTR3216SECK-J3-PRV/754-APTR3216SECK-J3-PRVCT-ND/10293112; Device Package: 1206 (3216 Metric); Height (Max): 1.25mm; LastUpdated: 9/2/2020 01:21:09; Lifecycle Status: Active; Minimum Order: 1; Mounting Type: Surface Mount; Package / Case: 1206 (3216 Metric); Packaging: TapeAndReel; PartId: 194; Part Status: Active; Price: 0.20; Series: Heli-R; Size / Dimension: 3.20mm L x 1.60mm W; Supplier 1: DigiKey; Supplier Part Number 1: 754-APTR3216SECK/J3-PRVCT-ND; Supplier Device Package: 1206; Value: Red
D3-D6 = DIO-T_3.3V-8.8V-SOD923: TVS DIODE 3.3V 8.8V SOD923; Manufacturer: MCC; Capacitance: 35pF; Current Rating: 10mA; Number of Unidirectional Channels: 1; Min Breakdown Voltage: 5V; Clamping Voltage: 5.8V; Peak Pulse Power: 100W; Power Line Protection: No; Peak Pulse Current: 5A; Diode Type: ZENER; Supplier 1: Digi-Key; Manufacturer Part Number: ESD3V3D9-TP; RoHS: Yes; Category: TVS Diodes; Stock 1: 2991; Pricing 1: 1=0.29000, 10=0.23600, 100=0.12540, 500=0.08250, 1000=0.05610, 2000=0.05060 (USD); Mount: Surface Mount; Min Operating Temperature: -55°C; Max Operating Temperature: 150°C; Package Quantity: 1; Packaging: Tape and Reel; Operating Supply Voltage: 3.3V; Reverse Standoff Voltage: 3.3V; Breakdown Voltage: 5V; Number of Channels: 1; Max Power Dissipation: 100W; Termination: SMD/SMT; Resistor Type: Zener; Series: -; Lead Free: Lead Free; RoHS Compliant: Yes; ComponentLink1URL: https://datasheet.ciiva.com/333/esd3v3d9sod-923-333173.pdf?src-supplier=Digi-Key; ComponentLink1Description: https://datasheet.ciiva.com/333/esd3v3d9sod-923-333173.pdf?src-supplier=Digi-Key; ComponentLink2URL: https://datasheet.ciiva.com/4479/esd3v3d9sod-923-36448-4479598.pdf?src-supplier=Mouser; ComponentLink2Description: https://datasheet.ciiva.com/4479/esd3v3d9sod-923-36448-4479598.pdf?src-supplier=Mouser; ComponentLink3URL: https://datasheet.ciiva.com/333/esd3v3d9sod-923-333174.pdf?src-supplier=Digi-Key; ComponentLink3Description: https://datasheet.ciiva.com/333/esd3v3d9sod-923-333174.pdf?src-supplier=Digi-Key; ComponentLink4URL: https://datasheet.ciiva.com/333/esd3v3d9sod-923-333175.pdf?src-supplier=Digi-Key; ComponentLink4Description: https://datasheet.ciiva.com/333/esd3v3d9sod-923-333175.pdf?src-supplier=Digi-Key; Supplier Part Number 1: ESD3V3D9-TPMSCT-ND
FB1 = BLM31KN102SZ1L: FERRITE BEAD 1 KOHM 1206 1LN; Manufacturer: Murata Electronics; Current Rating (Max): 2A; DC Resistance (DCR) (Max): 75mOhm; Filter Type: Power Line; Number of Lines: 1; Part Number: BLM31KN102SZ1L; ComponentLink1Description: Datasheet; ComponentLink1URL: https://www.murata.com/en-global/products/productdata/8796751200286/QNFA9115.pdf; ComponentLink2Description: DigiKey Link; ComponentLink2URL: http://digikey.com/product-detail/en/murata-electronics/BLM31KN102SZ1L/490-16522-1-ND/7564150; Device Package: 1206 (3216 Metric); Height (Max): 0.071" (1.80mm); Impedance @ Frequency: 1 kOhms @ 100MHz; LastUpdated: 02/09/2020 01:18:24; Lifecycle Status: Active; Minimum Order: 1; Mounting Type: Surface Mount; Operating Temperature: -55°C ~ 125°C; Package / Case: 1206 (3216 Metric); Packaging: TapeAndReel; PartId: 1565; Part Status: Active; Price: 0.10; Ratings: AEC-Q200; Series: BLM; Size / Dimension: 0.126" L x 0.063" W (3.20mm x 1.60mm); Supplier 1: DigiKey; Supplier Part Number 1: 490-16522-1-ND; Value: 1 kOhms @ 100MHz
J3 = CON-SKT-RJ_8C8P-RA-TH: 8 Pins, 2 Row 2.54mm Pitch, right angle Connector, male; Manufacturer: Assmann; Manufacturer Part Number: A-2004-2-4-LPS-N-R; Alternate Part Number-1: NA; Case/Package: TH-CON; Supplier-1: SP ROAD; Supplier Part Number-1: A-2004-2-4-LPS-N-R
R5 R7 R8 R47 = CRCW080510K0FKEA: as R1 on sheet [3]-Debugger_STM32F103; Part Number: CRCW080510K0FKEA; Value: 10 kOhms; ComponentLink1Description: Datasheet; ComponentLink1URL: http://www.vishay.com/docs/20035/dcrcwe3.pdf; ComponentLink2Description: DigiKey Link; ComponentLink2URL: http://digikey.com/product-detail/en/vishay-dale/CRCW080510K0FKEA/541-10.0KCCT-ND/1180897; Composition: Thick Film; Device Package: 0805 (2012 Metric); Features: Automotive AEC-Q200; Height - Seated (Max): 0.020" (0.50mm); LastUpdated: 02/09/2020 01:15:23; Lifecycle Status: Active; Minimum Order: 1; Number of Terminations: 2; Operating Temperature: -55°C ~ 155°C; Package / Case: 0805 (2012 Metric); Packaging: TapeAndReel; PartId: 28101; Part Status: Active; Price: 0.01; Ratings: AEC-Q200; Resistance: 10 kOhms; Series: CRCW; Size / Dimension: 0.079" L x 0.049" W (2.00mm x 1.25mm); Supplier 1: DigiKey; Supplier Part Number 1: 541-10.0KCCT-ND; Supplier Device Package: 0805; Tolerance: ±1%
R6 = RMCF0805FT6K49: RES 6.49K OHM 1% 1/8W 0805; Manufacturer: Stackpole Electronics Inc; Power (Watts): 0.125W, 1/8W; Temperature Coefficient: ±100ppm/°C; Part Number: RMCF0805FT6K49; Value: 6.49 kOhms; ComponentLink1Description: Datasheet; ComponentLink1URL: https://www.seielect.com/catalog/sei-rmcf_rmcp.pdf; ComponentLink2Description: DigiKey Link; ComponentLink2URL: http://digikey.com/product-detail/en/stackpole-electronics-inc/RMCF0805FT6K49/RMCF0805FT6K49CT-ND/1942423; Composition: Thick Film; Device Package: 0805 (2012 Metric); Features: Automotive AEC-Q200; Height - Seated (Max): 0.026" (0.65mm); LastUpdated: 02/09/2020 01:14:25; Lifecycle Status: Active; Minimum Order: 1; Number of Terminations: 2; Operating Temperature: -55°C ~ 155°C; Package / Case: 0805 (2012 Metric); Packaging: CutTape; PartId: 49590; Part Status: Active; Price: 0.10; Ratings: AEC-Q200; Resistance: 6.49 kOhms; Series: RMCF; Size / Dimension: 0.079" L x 0.049" W (2.00mm x 1.25mm); Supplier 1: DigiKey; Supplier Part Number 1: RMCF0805FT6K49CT-ND; Supplier Device Package: 0805; Tolerance: ±1%
R9 R10 = ERJ-3EKF3301V: RES SMD 3.3K OHM 1% 1/10W 0603; Manufacturer: Panasonic Electronic Components; Power (Watts): 0.1W, 1/10W; Temperature Coefficient: ±100ppm/°C; Part Number: ERJ-3EKF3301V; Value: 3.3 kOhms; ComponentLink1Description: Datasheet; ComponentLink1URL: https://industrial.panasonic.com/cdbs/www-data/pdf/RDA0000/AOA0000C304.pdf; ComponentLink2Description: DigiKey Link; ComponentLink2URL: http://digikey.com/product-detail/en/panasonic-electronic-components/ERJ-3EKF3301V/P3.30KHCT-ND/1746762; Composition: Thick Film; Device Package: 0603 (1608 Metric); Features: Automotive AEC-Q200; Height - Seated (Max): 0.022" (0.55mm); LastUpdated: 9/2/2020 01:10:23; Lifecycle Status: Active; Minimum Order: 1; Number of Terminations: 2; Operating Temperature: -55°C ~ 155°C; Package / Case: 0603 (1608 Metric); Packaging: TapeAndReel; PartId: 5657; Part Status: Active; Price: 0.01; Ratings: AEC-Q200; Resistance: 3.3 kOhms; Series: ERJ; Size / Dimension: 0.063" L x 0.031" W (1.60mm x 0.80mm); Supplier 1: DigiKey; Supplier Part Number 1: P3.30KHCT-ND; Supplier Device Package: 0603; Tolerance: ±1%
R11 = CRG1206F1M0: RES SMD 1M OHM 1% 1/4W 1206; Manufacturer: TE Connectivity Passive Product; Power (Watts): 0.25W, 1/4W; Temperature Coefficient: ±100ppm/°C; Part Number: CRG1206F1M0; ComponentLink1Description: Datasheet; ComponentLink1URL: https://www.te.com/commerce/DocumentDelivery/DDEController?Action=srchrtrv&DocNm=1773204&DocType=DS&DocLang=English; ComponentLink2Description: DigiKey Link; ComponentLink2URL: http://digikey.com/product-detail/en/te-connectivity-passive-product/CRG1206F1M0/A106072CT-ND/3477725; Composition: Thick Film; Device Package: 1206 (3216 Metric); Height - Seated (Max): 0.026" (0.65mm); LastUpdated: 02/09/2020 01:13:10; Lifecycle Status: Active; Minimum Order: 1; Number of Terminations: 2; Operating Temperature: -55°C ~ 155°C; Package / Case: 1206 (3216 Metric); Packaging: TapeAndReel; PartId: 26984; Part Status: Active; Price: 0.01; Resistance: 1 MOhms; Series: CRG, Neohm; Size / Dimension: 0.122" L x 0.061" W (3.10mm x 1.55mm); Supplier 1: DigiKey; Supplier Part Number 1: A106072CT-ND; Supplier Device Package: 1206; Tolerance: ±1%; Value: 1 MOhms
S2 = 1-1977223-1: as S1 on sheet [3]-Debugger_STM32F103; Part Number: 1-1977223-1; Circuit: SPST-NO; ComponentLink1Description: Datasheet; ComponentLink1URL: https://www.te.com/commerce/DocumentDelivery/DDEController?Action=srchrtrv&DocNm=1308111-1_SWITCHES_CORE_PROGRAM_CATALOG&DocType=CS&DocLang=English; ComponentLink2Description: DigiKey Link; ComponentLink2URL: http://digikey.com/product-detail/en/te-connectivity-alcoswitch-switches/1-1977223-1/1-1977223-1-ND/5597032; LastUpdated: 02/09/2020 01:27:07; Lifecycle Status: Active; Minimum Order: 0; Mounting Type: Surface Mount; Price: 0; Series: FSMJSMA; Supplier 1: DigiKey; Supplier Part Number 1: 1-1977223-1-ND; Termination Style: Gull Wing
U2 = IC_DP83826IRHBR: Ethernet MAC Controller IEEE 802.3, 10/100 Base-T/TX PHY MII, RMII Interface 32-VQFN (5x5); Manufacturer: Texas Instruments; Supplier 1: Digi-Key; Manufacturer Part Number: DP83826IRHBR; RoHS: Yes; Pricing 1: 1=2.14000, 10=1.91900, 25=1.81000, 100=1.54210, 250=1.44796, 500=1.26696, 1000=1.14061 (USD); Supplier Part Number 1: 296-DP83826IRHBRCT-ND
Y1 = ABLS-25.000MHZ-20-D2YF-T: CRYSTAL 25.000MHZ 20PF SMD; Manufacturer: Abracon LLC; ESR (Equivalent Series Resistance): 40 Ohms; Frequency Stability: ±30ppm; Frequency Tolerance: ±20ppm; Operating Mode: Fundamental; Part Number: ABLS-25.000MHZ-20-D2YF-T; ComponentLink1Description: Datasheet; ComponentLink1URL: https://abracon.com/Resonators/abls.pdf; ComponentLink2Description: DigiKey Link; ComponentLink2URL: http://digikey.com/product-detail/en/abracon-llc/ABLS-25.000MHZ-20-D2YF-T/535-14354-1-ND/8582115; Frequency: 25MHz; Height - Seated (Max): 0.165" (4.20mm); LastUpdated: 02/09/2020 01:21:46; Lifecycle Status: Active; Load Capacitance: 20pF; Minimum Order: 1; Mounting Type: Surface Mount; Operating Temperature: -40°C ~ 85°C; Package / Case: HC-49/US; Packaging: TapeAndReel; PartId: 14; Part Status: Active; Price: 0.24; Series: ABLS; Size / Dimension: 0.449" L x 0.185" W (11.40mm x 4.70mm); Supplier 1: DigiKey; Supplier Part Number 1: 535-14354-1-ND; Type: MHz Crystal; Value: 25MHz